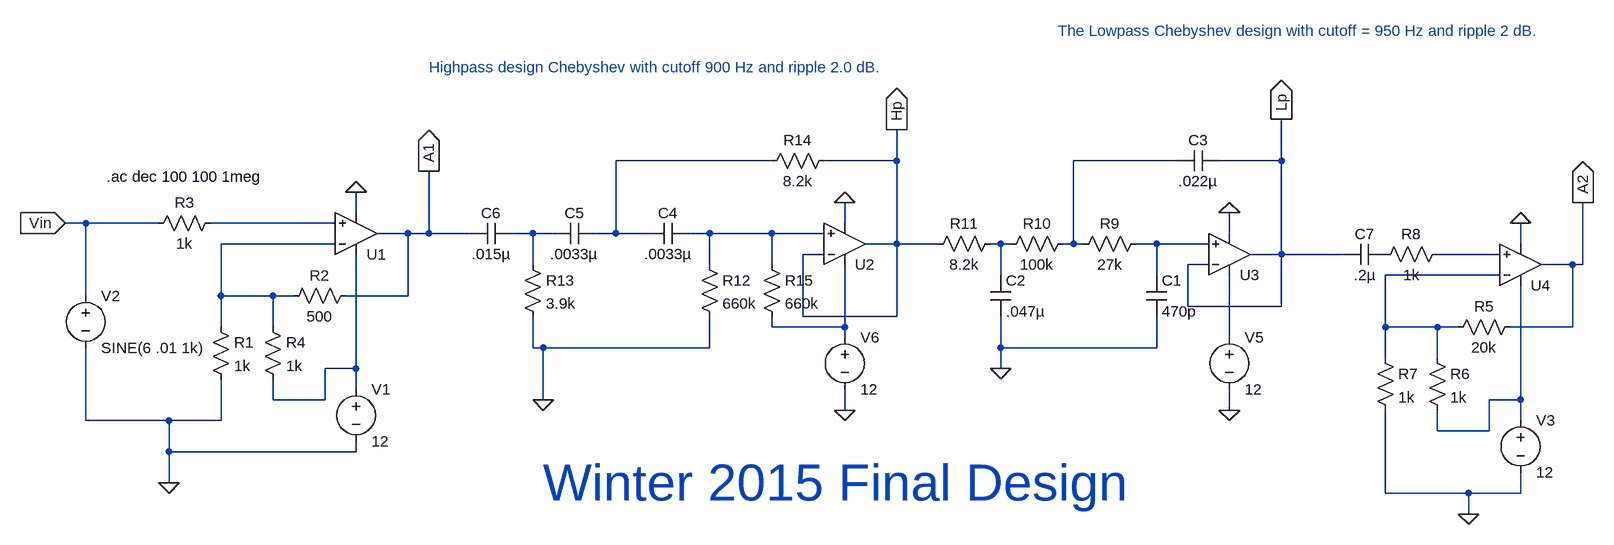
[diagram p0: schematic WholeSystem_v3.asc]
WholeSystem_v3.asc, the LTspice schematic file:
Version 4
SHEET 1 2448 680
WIRE 800 64 560 64
WIRE 992 64 992 16
WIRE 992 64 880 64
WIRE 1424 64 1264 64
WIRE 1584 64 1584 0
WIRE 1584 64 1488 64
WIRE 160 144 160 112
WIRE -256 160 -288 160
WIRE -144 160 -256 160
WIRE 128 160 -64 160
WIRE 912 160 912 128
WIRE 240 176 192 176
WIRE 272 176 272 80
WIRE 272 176 240 176
WIRE 336 176 272 176
WIRE 432 176 400 176
WIRE 464 176 432 176
WIRE 560 176 560 64
WIRE 560 176 528 176
WIRE 608 176 560 176
WIRE 704 176 672 176
WIRE 800 176 704 176
WIRE 880 176 800 176
WIRE 1504 176 1504 144
WIRE 128 192 -48 192
WIRE 992 192 992 64
WIRE 992 192 944 192
WIRE 1056 192 992 192
WIRE 1152 192 1136 192
WIRE 1168 192 1152 192
WIRE 1264 192 1264 64
WIRE 1264 192 1248 192
WIRE 1280 192 1264 192
WIRE 1392 192 1360 192
WIRE 1472 192 1392 192
WIRE 1952 192 1952 160
WIRE 880 208 848 208
WIRE 1584 208 1584 64
WIRE 1584 208 1536 208
WIRE 1680 208 1584 208
WIRE 1920 208 1824 208
WIRE 432 224 432 176
WIRE 704 224 704 176
WIRE 800 224 800 176
WIRE 1472 224 1440 224
WIRE 2032 224 1984 224
WIRE 2048 224 2048 128
WIRE 2048 224 2032 224
WIRE 1152 240 1152 192
WIRE 1392 240 1392 192
WIRE 1920 240 1744 240
WIRE -256 272 -256 160
WIRE -48 272 -48 192
WIRE 32 272 -48 272
WIRE 64 272 32 272
WIRE 240 272 240 176
WIRE 240 272 144 272
WIRE 1440 288 1440 224
WIRE 1584 288 1584 208
WIRE 1584 288 1440 288
WIRE 848 304 848 208
WIRE 992 304 992 192
WIRE 992 304 848 304
WIRE -48 320 -48 272
WIRE 32 320 32 272
WIRE 800 320 800 304
WIRE 912 320 912 224
WIRE 912 320 800 320
WIRE 1744 320 1744 240
WIRE 1824 320 1744 320
WIRE 1856 320 1824 320
WIRE 2032 320 2032 224
WIRE 2032 320 1936 320
WIRE 912 336 912 320
WIRE 1504 336 1504 240
WIRE 432 352 432 304
WIRE 448 352 432 352
WIRE 704 352 704 304
WIRE 704 352 448 352
WIRE 1152 352 1152 304
WIRE 1392 352 1392 304
WIRE 1392 352 1152 352
WIRE 1744 368 1744 320
WIRE 1824 368 1824 320
WIRE 160 384 160 208
WIRE 160 384 112 384
WIRE 1152 384 1152 352
WIRE 160 416 160 384
WIRE 32 432 32 400
WIRE 112 432 112 384
WIRE 112 432 32 432
WIRE 448 432 448 352
WIRE 1952 432 1952 256
WIRE 1952 432 1904 432
WIRE 912 448 912 416
WIRE 1504 448 1504 416
WIRE -256 464 -256 352
WIRE -128 464 -256 464
WIRE -48 464 -48 400
WIRE -48 464 -128 464
WIRE 1952 464 1952 432
WIRE 1824 480 1824 448
WIRE 1904 480 1904 432
WIRE 1904 480 1824 480
WIRE -128 512 -128 464
WIRE 160 512 160 496
WIRE 160 512 -128 512
WIRE -128 560 -128 512
WIRE 1744 576 1744 448
WIRE 1872 576 1744 576
WIRE 1952 576 1952 544
WIRE 1952 576 1872 576
WIRE 1872 608 1872 576
FLAG 160 112 0
FLAG -128 560 0
FLAG 1952 160 0
FLAG 1872 608 0
FLAG 1152 384 0
FLAG 1504 448 0
FLAG 448 432 0
FLAG 912 448 0
FLAG 912 128 0
FLAG 1504 144 0
FLAG -288 160 Vin
IOPIN -288 160 In
FLAG 272 80 A1
IOPIN 272 80 Out
FLAG 2048 128 A2
IOPIN 2048 128 Out
FLAG 992 16 Hp
IOPIN 992 16 Out
FLAG 1584 0 Lp
IOPIN 1584 0 Out
SYMBOL voltage 160 400 R0
SYMATTR InstName V1
SYMATTR Value 12
SYMBOL res -64 304 R0
SYMATTR InstName R1
SYMATTR Value 1k
SYMBOL res 160 256 R90
WINDOW 0 0 56 VBottom 2
WINDOW 3 32 56 VTop 2
SYMATTR InstName R2
SYMATTR Value 500
SYMBOL voltage -256 256 R0
SYMATTR InstName V2
SYMATTR Value SINE(6 .01 1k)
SYMATTR Value2 AC 1
SYMBOL res -48 144 R90
WINDOW 0 0 56 VBottom 2
WINDOW 3 32 56 VTop 2
SYMATTR InstName R3
SYMATTR Value 1k
SYMBOL res 16 304 R0
SYMATTR InstName R4
SYMATTR Value 1k
SYMBOL voltage 1952 448 R0
SYMATTR InstName V3
SYMATTR Value 12
SYMBOL res 1952 304 R90
WINDOW 0 0 56 VBottom 2
WINDOW 3 32 56 VTop 2
SYMATTR InstName R5
SYMATTR Value 20k
SYMBOL res 1808 352 R0
SYMATTR InstName R6
SYMATTR Value 1k
SYMBOL res 1728 352 R0
SYMATTR InstName R7
SYMATTR Value 1k
SYMBOL res 1840 192 R90
WINDOW 0 0 56 VBottom 2
WINDOW 3 32 56 VTop 2
SYMATTR InstName R8
SYMATTR Value 1k
SYMBOL res 1376 176 R90
WINDOW 0 0 56 VBottom 2
WINDOW 3 32 56 VTop 2
SYMATTR InstName R9
SYMATTR Value 27k
SYMBOL res 1264 176 R90
WINDOW 0 0 56 VBottom 2
WINDOW 3 32 56 VTop 2
SYMATTR InstName R10
SYMATTR Value 100k
SYMBOL res 1152 176 R90
WINDOW 0 0 56 VBottom 2
WINDOW 3 32 56 VTop 2
SYMATTR InstName R11
SYMATTR Value 8.2k
SYMBOL cap 1376 240 R0
SYMATTR InstName C1
SYMATTR Value 470p
SYMBOL cap 1136 240 R0
SYMATTR InstName C2
SYMATTR Value .047µ
SYMBOL cap 1488 48 R90
WINDOW 0 0 32 VBottom 2
WINDOW 3 32 32 VTop 2
SYMATTR InstName C3
SYMATTR Value .022µ
SYMBOL voltage 1504 320 R0
SYMATTR InstName V5
SYMATTR Value 12
SYMBOL cap 672 160 R90
WINDOW 0 0 32 VBottom 2
WINDOW 3 32 32 VTop 2
SYMATTR InstName C4
SYMATTR Value .0033µ
SYMBOL cap 528 160 R90
WINDOW 0 0 32 VBottom 2
WINDOW 3 32 32 VTop 2
SYMATTR InstName C5
SYMATTR Value .0033µ
SYMBOL cap 400 160 R90
WINDOW 0 0 32 VBottom 2
WINDOW 3 32 32 VTop 2
SYMATTR InstName C6
SYMATTR Value .015µ
SYMBOL res 688 208 R0
SYMATTR InstName R12
SYMATTR Value 660k
SYMBOL res 416 208 R0
SYMATTR InstName R13
SYMATTR Value 3.9k
SYMBOL res 896 48 R90
WINDOW 0 0 56 VBottom 2
WINDOW 3 32 56 VTop 2
SYMATTR InstName R14
SYMATTR Value 8.2k
SYMBOL voltage 912 320 R0
SYMATTR InstName V6
SYMATTR Value 12
SYMBOL res 784 208 R0
SYMATTR InstName R15
SYMATTR Value 660k
SYMBOL cap 1744 192 R90
WINDOW 0 0 32 VBottom 2
WINDOW 3 32 32 VTop 2
SYMATTR InstName C7
SYMATTR Value .2µ
SYMBOL Opamps/UniversalOpamp2 160 176 M180
SYMATTR InstName U1
SYMBOL Opamps/UniversalOpamp2 912 192 M180
SYMATTR InstName U2
SYMBOL Opamps/UniversalOpamp2 1504 208 M180
SYMATTR InstName U3
SYMBOL Opamps/UniversalOpamp2 1952 224 M180
SYMATTR InstName U4
TEXT -224 88 Left 2 !.ac dec 100 100 1meg
TEXT 1240 -136 Left 2 ;The Lowpass Chebyshev design with cutoff = 950 Hz and ripple 2 dB.
TEXT 272 -80 Left 2 ;Highpass design Chebyshev with cutoff 900 Hz and ripple 2.0 dB.
TEXT 448 560 Left 6 ;Winter 2015 Final Design

The netlist it stands for:
* WholeSystem_v3.asc
V1 N013 0 12
R1 N006 0 1k
R2 A1 N006 500
V2 Vin 0 SINE(6 .01 1k) AC 1
R3 N003 Vin 1k
R4 N006 N013 1k
V3 N014 0 12
R5 A2 N010 20k
R6 N010 N014 1k
R7 N010 0 1k
R8 N009 P001 1k
R9 N008 N002 27k
R10 N002 N007 100k
R11 N007 Hp 8.2k
C1 N008 0 470p
C2 N007 0 .047µ
C3 Lp N002 .022µ
V5 N012 0 12
C4 N005 N001 .0033µ
C5 N001 N004 .0033µ
C6 N004 A1 .015µ
R12 N005 0 660k
R13 N004 0 3.9k
R14 Hp N001 8.2k
V6 N011 0 12
R15 N005 N011 660k
C7 P001 Lp .2µ
XU1 N003 N006 N013 0 A1 level.2 Avol=1Meg GBW=10Meg Slew=10Meg ilimit=25m rail=0 Vos=0 phimargin=45 en=0 enk=0 in=0 ink=0 Rin=500Meg  ; pins IN+ IN- V+ V- OUT
XU2 N005 Hp N011 0 Hp level.2 Avol=1Meg GBW=10Meg Slew=10Meg ilimit=25m rail=0 Vos=0 phimargin=45 en=0 enk=0 in=0 ink=0 Rin=500Meg  ; pins IN+ IN- V+ V- OUT
XU3 N008 Lp N012 0 Lp level.2 Avol=1Meg GBW=10Meg Slew=10Meg ilimit=25m rail=0 Vos=0 phimargin=45 en=0 enk=0 in=0 ink=0 Rin=500Meg  ; pins IN+ IN- V+ V- OUT
XU4 N009 N010 N014 0 A2 level.2 Avol=1Meg GBW=10Meg Slew=10Meg ilimit=25m rail=0 Vos=0 phimargin=45 en=0 enk=0 in=0 ink=0 Rin=500Meg  ; pins IN+ IN- V+ V- OUT
.ac dec 100 100 1meg
* The Lowpass Chebyshev design with cutoff = 950 Hz and ripple 2 dB.
* Highpass design Chebyshev with cutoff 900 Hz and ripple 2.0 dB.
* Winter 2015 Final Design
.lib UniversalOpamps2.sub
.backanno
.end